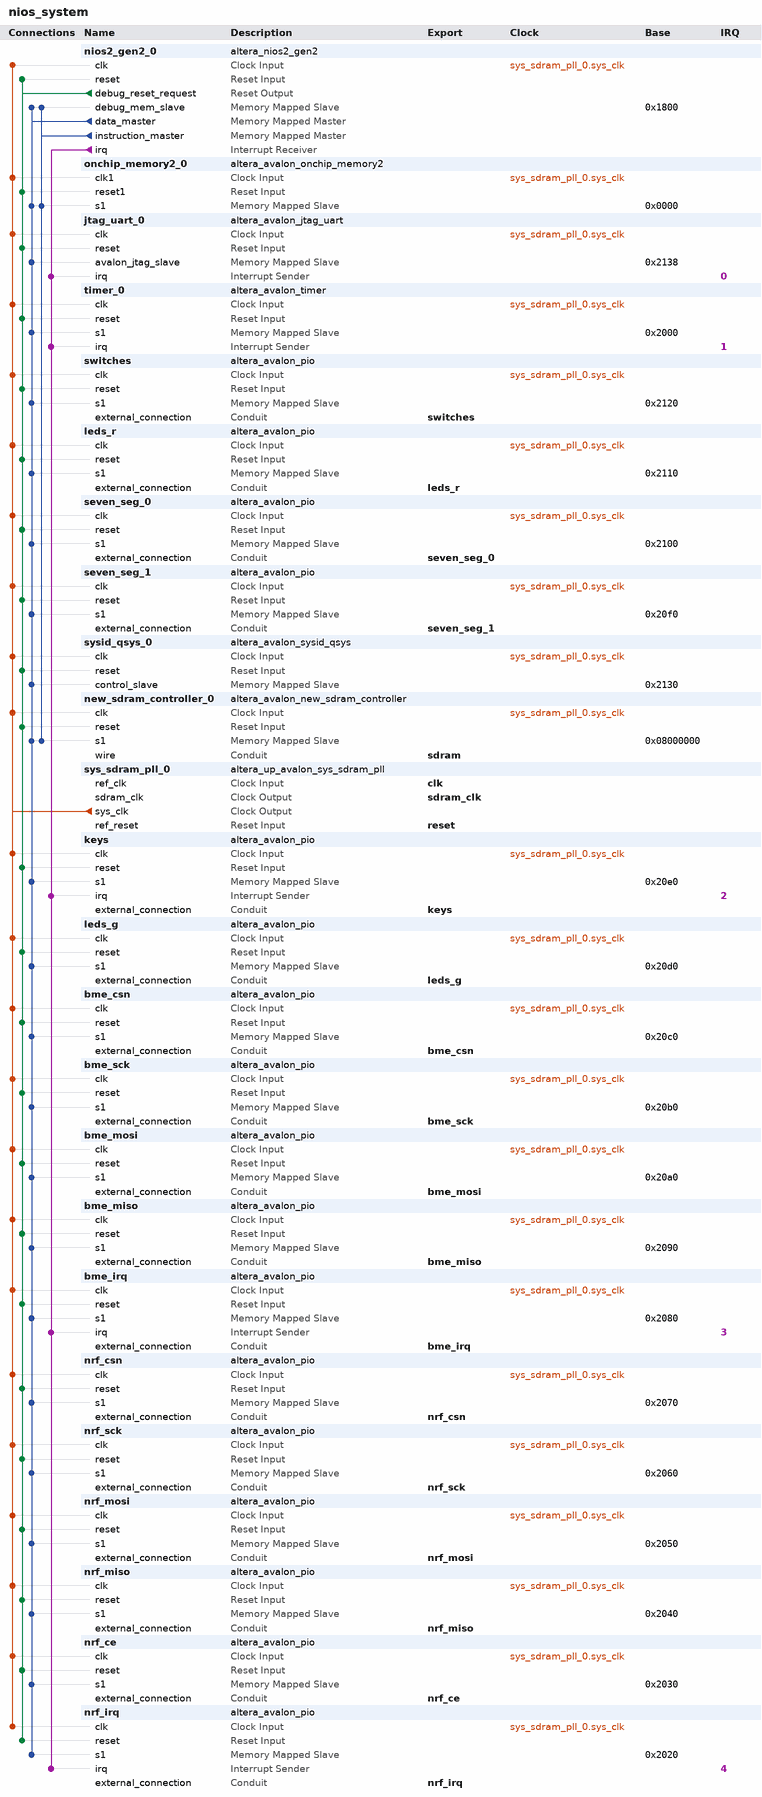
[diagram p0: system contents]
# Platform Designer (Qsys) system nios_system, Cyclone IV E EP4CE115F29C7
# Parameters at their usual value, and those the tool derives, are not listed.
package require -exact qsys 16.1
create_system nios_system
set_project_property DEVICE_FAMILY {Cyclone IV E}
set_project_property DEVICE EP4CE115F29C7

add_instance nios2_gen2_0 altera_nios2_gen2 16.1
set_instance_parameter_value nios2_gen2_0 dcache_size 2048
set_instance_parameter_value nios2_gen2_0 exceptionSlave new_sdram_controller_0.s1
set_instance_parameter_value nios2_gen2_0 icache_size 4096
set_instance_parameter_value nios2_gen2_0 impl Fast
set_instance_parameter_value nios2_gen2_0 resetSlave new_sdram_controller_0.s1

add_instance onchip_memory2_0 altera_avalon_onchip_memory2 16.1
set_instance_parameter_value onchip_memory2_0 dataWidth 32
set_instance_parameter_value onchip_memory2_0 dualPort false
set_instance_parameter_value onchip_memory2_0 initMemContent true
set_instance_parameter_value onchip_memory2_0 initializationFileName onchip_mem.hex
set_instance_parameter_value onchip_memory2_0 memorySize 4096

add_instance jtag_uart_0 altera_avalon_jtag_uart 16.1
set_instance_parameter_value jtag_uart_0 simInteractiveOptions NO_INTERACTIVE_WINDOWS

add_instance timer_0 altera_avalon_timer 16.1
set_instance_parameter_value timer_0 period 1
set_instance_parameter_value timer_0 periodUnits MSEC

add_instance switches altera_avalon_pio 16.1
set_instance_parameter_value switches direction Input
set_instance_parameter_value switches edgeType FALLING
set_instance_parameter_value switches width 32

add_instance leds_r altera_avalon_pio 16.1
set_instance_parameter_value leds_r direction Output
set_instance_parameter_value leds_r width 32

add_instance seven_seg_0 altera_avalon_pio 16.1
set_instance_parameter_value seven_seg_0 direction Output
set_instance_parameter_value seven_seg_0 width 32

add_instance seven_seg_1 altera_avalon_pio 16.1
set_instance_parameter_value seven_seg_1 direction Output
set_instance_parameter_value seven_seg_1 width 32

add_instance sysid_qsys_0 altera_avalon_sysid_qsys 16.1
set_instance_parameter_value sysid_qsys_0 id 0

add_instance new_sdram_controller_0 altera_avalon_new_sdram_controller 16.1
set_instance_parameter_value new_sdram_controller_0 TAC 5.5
set_instance_parameter_value new_sdram_controller_0 TRCD 20.0
set_instance_parameter_value new_sdram_controller_0 TRP 20.0
set_instance_parameter_value new_sdram_controller_0 casLatency 3
set_instance_parameter_value new_sdram_controller_0 columnWidth 8
set_instance_parameter_value new_sdram_controller_0 dataWidth 32
set_instance_parameter_value new_sdram_controller_0 generateSimulationModel false
set_instance_parameter_value new_sdram_controller_0 model single_Micron_MT48LC4M32B2_7_chip
set_instance_parameter_value new_sdram_controller_0 numberOfBanks 4
set_instance_parameter_value new_sdram_controller_0 numberOfChipSelects 1
set_instance_parameter_value new_sdram_controller_0 powerUpDelay 100.0
set_instance_parameter_value new_sdram_controller_0 refreshPeriod 15.625
set_instance_parameter_value new_sdram_controller_0 rowWidth 12

add_instance sys_sdram_pll_0 altera_up_avalon_sys_sdram_pll 16.1
set_instance_parameter_value sys_sdram_pll_0 CV_boards DE1-SoC
set_instance_parameter_value sys_sdram_pll_0 gui_outclk 50.0
set_instance_parameter_value sys_sdram_pll_0 gui_refclk 50.0

add_instance keys altera_avalon_pio 16.1
set_instance_parameter_value keys captureEdge true
set_instance_parameter_value keys direction Input
set_instance_parameter_value keys edgeType FALLING
set_instance_parameter_value keys generateIRQ true
set_instance_parameter_value keys irqType EDGE
set_instance_parameter_value keys width 4

add_instance leds_g altera_avalon_pio 16.1
set_instance_parameter_value leds_g direction Output
set_instance_parameter_value leds_g width 8

add_instance bme_csn altera_avalon_pio 16.1
set_instance_parameter_value bme_csn direction Output
set_instance_parameter_value bme_csn width 1

add_instance bme_sck altera_avalon_pio 16.1
set_instance_parameter_value bme_sck direction Output
set_instance_parameter_value bme_sck width 1

add_instance bme_mosi altera_avalon_pio 16.1
set_instance_parameter_value bme_mosi direction Output
set_instance_parameter_value bme_mosi width 1

add_instance bme_miso altera_avalon_pio 16.1
set_instance_parameter_value bme_miso direction Input
set_instance_parameter_value bme_miso width 1

add_instance bme_irq altera_avalon_pio 16.1
set_instance_parameter_value bme_irq direction Input
set_instance_parameter_value bme_irq generateIRQ true
set_instance_parameter_value bme_irq width 1

add_instance nrf_csn altera_avalon_pio 16.1
set_instance_parameter_value nrf_csn direction Output
set_instance_parameter_value nrf_csn width 1

add_instance nrf_sck altera_avalon_pio 16.1
set_instance_parameter_value nrf_sck direction Output
set_instance_parameter_value nrf_sck width 1

add_instance nrf_mosi altera_avalon_pio 16.1
set_instance_parameter_value nrf_mosi direction Output
set_instance_parameter_value nrf_mosi width 1

add_instance nrf_miso altera_avalon_pio 16.1
set_instance_parameter_value nrf_miso direction Input
set_instance_parameter_value nrf_miso width 1

add_instance nrf_ce altera_avalon_pio 16.1
set_instance_parameter_value nrf_ce direction Output
set_instance_parameter_value nrf_ce width 1

add_instance nrf_irq altera_avalon_pio 16.1
set_instance_parameter_value nrf_irq direction Input
set_instance_parameter_value nrf_irq generateIRQ true
set_instance_parameter_value nrf_irq width 1

# connections
add_connection sys_sdram_pll_0.sys_clk bme_csn.clk clock
add_connection sys_sdram_pll_0.sys_clk bme_irq.clk clock
add_connection sys_sdram_pll_0.sys_clk bme_miso.clk clock
add_connection sys_sdram_pll_0.sys_clk bme_mosi.clk clock
add_connection sys_sdram_pll_0.sys_clk bme_sck.clk clock
add_connection sys_sdram_pll_0.sys_clk jtag_uart_0.clk clock
add_connection sys_sdram_pll_0.sys_clk keys.clk clock
add_connection sys_sdram_pll_0.sys_clk leds_g.clk clock
add_connection sys_sdram_pll_0.sys_clk leds_r.clk clock
add_connection sys_sdram_pll_0.sys_clk new_sdram_controller_0.clk clock
add_connection sys_sdram_pll_0.sys_clk nios2_gen2_0.clk clock
add_connection sys_sdram_pll_0.sys_clk nrf_ce.clk clock
add_connection sys_sdram_pll_0.sys_clk nrf_csn.clk clock
add_connection sys_sdram_pll_0.sys_clk nrf_irq.clk clock
add_connection sys_sdram_pll_0.sys_clk nrf_miso.clk clock
add_connection sys_sdram_pll_0.sys_clk nrf_mosi.clk clock
add_connection sys_sdram_pll_0.sys_clk nrf_sck.clk clock
add_connection sys_sdram_pll_0.sys_clk onchip_memory2_0.clk1 clock
add_connection sys_sdram_pll_0.sys_clk seven_seg_0.clk clock
add_connection sys_sdram_pll_0.sys_clk seven_seg_1.clk clock
add_connection sys_sdram_pll_0.sys_clk switches.clk clock
add_connection sys_sdram_pll_0.sys_clk sysid_qsys_0.clk clock
add_connection sys_sdram_pll_0.sys_clk timer_0.clk clock
add_connection nios2_gen2_0.debug_reset_request bme_csn.reset reset
add_connection nios2_gen2_0.debug_reset_request bme_irq.reset reset
add_connection nios2_gen2_0.debug_reset_request bme_miso.reset reset
add_connection nios2_gen2_0.debug_reset_request bme_mosi.reset reset
add_connection nios2_gen2_0.debug_reset_request bme_sck.reset reset
add_connection nios2_gen2_0.debug_reset_request jtag_uart_0.reset reset
add_connection nios2_gen2_0.debug_reset_request keys.reset reset
add_connection nios2_gen2_0.debug_reset_request leds_g.reset reset
add_connection nios2_gen2_0.debug_reset_request leds_r.reset reset
add_connection nios2_gen2_0.debug_reset_request new_sdram_controller_0.reset reset
add_connection nios2_gen2_0.debug_reset_request nios2_gen2_0.reset reset
add_connection nios2_gen2_0.debug_reset_request nrf_ce.reset reset
add_connection nios2_gen2_0.debug_reset_request nrf_csn.reset reset
add_connection nios2_gen2_0.debug_reset_request nrf_irq.reset reset
add_connection nios2_gen2_0.debug_reset_request nrf_miso.reset reset
add_connection nios2_gen2_0.debug_reset_request nrf_mosi.reset reset
add_connection nios2_gen2_0.debug_reset_request nrf_sck.reset reset
add_connection nios2_gen2_0.debug_reset_request onchip_memory2_0.reset1 reset
add_connection nios2_gen2_0.debug_reset_request seven_seg_0.reset reset
add_connection nios2_gen2_0.debug_reset_request seven_seg_1.reset reset
add_connection nios2_gen2_0.debug_reset_request switches.reset reset
add_connection nios2_gen2_0.debug_reset_request sysid_qsys_0.reset reset
add_connection nios2_gen2_0.debug_reset_request timer_0.reset reset
add_connection nios2_gen2_0.data_master bme_csn.s1 avalon
set_connection_parameter_value nios2_gen2_0.data_master/bme_csn.s1 baseAddress 0x20c0
add_connection nios2_gen2_0.data_master bme_irq.s1 avalon
set_connection_parameter_value nios2_gen2_0.data_master/bme_irq.s1 baseAddress 0x2080
add_connection nios2_gen2_0.data_master bme_miso.s1 avalon
set_connection_parameter_value nios2_gen2_0.data_master/bme_miso.s1 baseAddress 0x2090
add_connection nios2_gen2_0.data_master bme_mosi.s1 avalon
set_connection_parameter_value nios2_gen2_0.data_master/bme_mosi.s1 baseAddress 0x20a0
add_connection nios2_gen2_0.data_master bme_sck.s1 avalon
set_connection_parameter_value nios2_gen2_0.data_master/bme_sck.s1 baseAddress 0x20b0
add_connection nios2_gen2_0.data_master jtag_uart_0.avalon_jtag_slave avalon
set_connection_parameter_value nios2_gen2_0.data_master/jtag_uart_0.avalon_jtag_slave baseAddress 0x2138
add_connection nios2_gen2_0.data_master keys.s1 avalon
set_connection_parameter_value nios2_gen2_0.data_master/keys.s1 baseAddress 0x20e0
add_connection nios2_gen2_0.data_master leds_g.s1 avalon
set_connection_parameter_value nios2_gen2_0.data_master/leds_g.s1 baseAddress 0x20d0
add_connection nios2_gen2_0.data_master leds_r.s1 avalon
set_connection_parameter_value nios2_gen2_0.data_master/leds_r.s1 baseAddress 0x2110
add_connection nios2_gen2_0.data_master new_sdram_controller_0.s1 avalon
set_connection_parameter_value nios2_gen2_0.data_master/new_sdram_controller_0.s1 baseAddress 0x08000000
add_connection nios2_gen2_0.data_master nios2_gen2_0.debug_mem_slave avalon
set_connection_parameter_value nios2_gen2_0.data_master/nios2_gen2_0.debug_mem_slave baseAddress 0x1800
add_connection nios2_gen2_0.data_master nrf_ce.s1 avalon
set_connection_parameter_value nios2_gen2_0.data_master/nrf_ce.s1 baseAddress 0x2030
add_connection nios2_gen2_0.data_master nrf_csn.s1 avalon
set_connection_parameter_value nios2_gen2_0.data_master/nrf_csn.s1 baseAddress 0x2070
add_connection nios2_gen2_0.data_master nrf_irq.s1 avalon
set_connection_parameter_value nios2_gen2_0.data_master/nrf_irq.s1 baseAddress 0x2020
add_connection nios2_gen2_0.data_master nrf_miso.s1 avalon
set_connection_parameter_value nios2_gen2_0.data_master/nrf_miso.s1 baseAddress 0x2040
add_connection nios2_gen2_0.data_master nrf_mosi.s1 avalon
set_connection_parameter_value nios2_gen2_0.data_master/nrf_mosi.s1 baseAddress 0x2050
add_connection nios2_gen2_0.data_master nrf_sck.s1 avalon
set_connection_parameter_value nios2_gen2_0.data_master/nrf_sck.s1 baseAddress 0x2060
add_connection nios2_gen2_0.data_master onchip_memory2_0.s1 avalon
set_connection_parameter_value nios2_gen2_0.data_master/onchip_memory2_0.s1 baseAddress 0x0000
add_connection nios2_gen2_0.data_master seven_seg_0.s1 avalon
set_connection_parameter_value nios2_gen2_0.data_master/seven_seg_0.s1 baseAddress 0x2100
add_connection nios2_gen2_0.data_master seven_seg_1.s1 avalon
set_connection_parameter_value nios2_gen2_0.data_master/seven_seg_1.s1 baseAddress 0x20f0
add_connection nios2_gen2_0.data_master switches.s1 avalon
set_connection_parameter_value nios2_gen2_0.data_master/switches.s1 baseAddress 0x2120
add_connection nios2_gen2_0.data_master sysid_qsys_0.control_slave avalon
set_connection_parameter_value nios2_gen2_0.data_master/sysid_qsys_0.control_slave baseAddress 0x2130
add_connection nios2_gen2_0.data_master timer_0.s1 avalon
set_connection_parameter_value nios2_gen2_0.data_master/timer_0.s1 baseAddress 0x2000
add_connection nios2_gen2_0.instruction_master new_sdram_controller_0.s1 avalon
set_connection_parameter_value nios2_gen2_0.instruction_master/new_sdram_controller_0.s1 baseAddress 0x08000000
add_connection nios2_gen2_0.instruction_master nios2_gen2_0.debug_mem_slave avalon
set_connection_parameter_value nios2_gen2_0.instruction_master/nios2_gen2_0.debug_mem_slave baseAddress 0x1800
add_connection nios2_gen2_0.instruction_master onchip_memory2_0.s1 avalon
set_connection_parameter_value nios2_gen2_0.instruction_master/onchip_memory2_0.s1 baseAddress 0x0000
add_connection nios2_gen2_0.irq bme_irq.irq interrupt
set_connection_parameter_value nios2_gen2_0.irq/bme_irq.irq irqNumber 3
add_connection nios2_gen2_0.irq jtag_uart_0.irq interrupt
set_connection_parameter_value nios2_gen2_0.irq/jtag_uart_0.irq irqNumber 0
add_connection nios2_gen2_0.irq keys.irq interrupt
set_connection_parameter_value nios2_gen2_0.irq/keys.irq irqNumber 2
add_connection nios2_gen2_0.irq nrf_irq.irq interrupt
set_connection_parameter_value nios2_gen2_0.irq/nrf_irq.irq irqNumber 4
add_connection nios2_gen2_0.irq timer_0.irq interrupt
set_connection_parameter_value nios2_gen2_0.irq/timer_0.irq irqNumber 1

# exported interfaces
add_interface bme_csn conduit end
set_interface_property bme_csn EXPORT_OF bme_csn.external_connection
add_interface bme_irq conduit end
set_interface_property bme_irq EXPORT_OF bme_irq.external_connection
add_interface bme_miso conduit end
set_interface_property bme_miso EXPORT_OF bme_miso.external_connection
add_interface bme_mosi conduit end
set_interface_property bme_mosi EXPORT_OF bme_mosi.external_connection
add_interface bme_sck conduit end
set_interface_property bme_sck EXPORT_OF bme_sck.external_connection
add_interface clk clock sink
set_interface_property clk EXPORT_OF sys_sdram_pll_0.ref_clk
add_interface keys conduit end
set_interface_property keys EXPORT_OF keys.external_connection
add_interface leds_g conduit end
set_interface_property leds_g EXPORT_OF leds_g.external_connection
add_interface leds_r conduit end
set_interface_property leds_r EXPORT_OF leds_r.external_connection
add_interface nrf_ce conduit end
set_interface_property nrf_ce EXPORT_OF nrf_ce.external_connection
add_interface nrf_csn conduit end
set_interface_property nrf_csn EXPORT_OF nrf_csn.external_connection
add_interface nrf_irq conduit end
set_interface_property nrf_irq EXPORT_OF nrf_irq.external_connection
add_interface nrf_miso conduit end
set_interface_property nrf_miso EXPORT_OF nrf_miso.external_connection
add_interface nrf_mosi conduit end
set_interface_property nrf_mosi EXPORT_OF nrf_mosi.external_connection
add_interface nrf_sck conduit end
set_interface_property nrf_sck EXPORT_OF nrf_sck.external_connection
add_interface reset reset sink
set_interface_property reset EXPORT_OF sys_sdram_pll_0.ref_reset
add_interface sdram conduit end
set_interface_property sdram EXPORT_OF new_sdram_controller_0.wire
add_interface sdram_clk clock source
set_interface_property sdram_clk EXPORT_OF sys_sdram_pll_0.sdram_clk
add_interface seven_seg_0 conduit end
set_interface_property seven_seg_0 EXPORT_OF seven_seg_0.external_connection
add_interface seven_seg_1 conduit end
set_interface_property seven_seg_1 EXPORT_OF seven_seg_1.external_connection
add_interface switches conduit end
set_interface_property switches EXPORT_OF switches.external_connection

set_interconnect_requirement {$system} qsys_mm.clockCrossingAdapter HANDSHAKE
set_interconnect_requirement {$system} qsys_mm.enableEccProtection FALSE
set_interconnect_requirement {$system} qsys_mm.insertDefaultSlave FALSE
set_interconnect_requirement {$system} qsys_mm.maxAdditionalLatency 1

save_system nios_system.qsys
